# EasyEDA schematic smopcb.json
TITLE: Sheet_1; REV: 1.0; Date: 2026-06-30; Sheet: 1/1; Company: Your Company
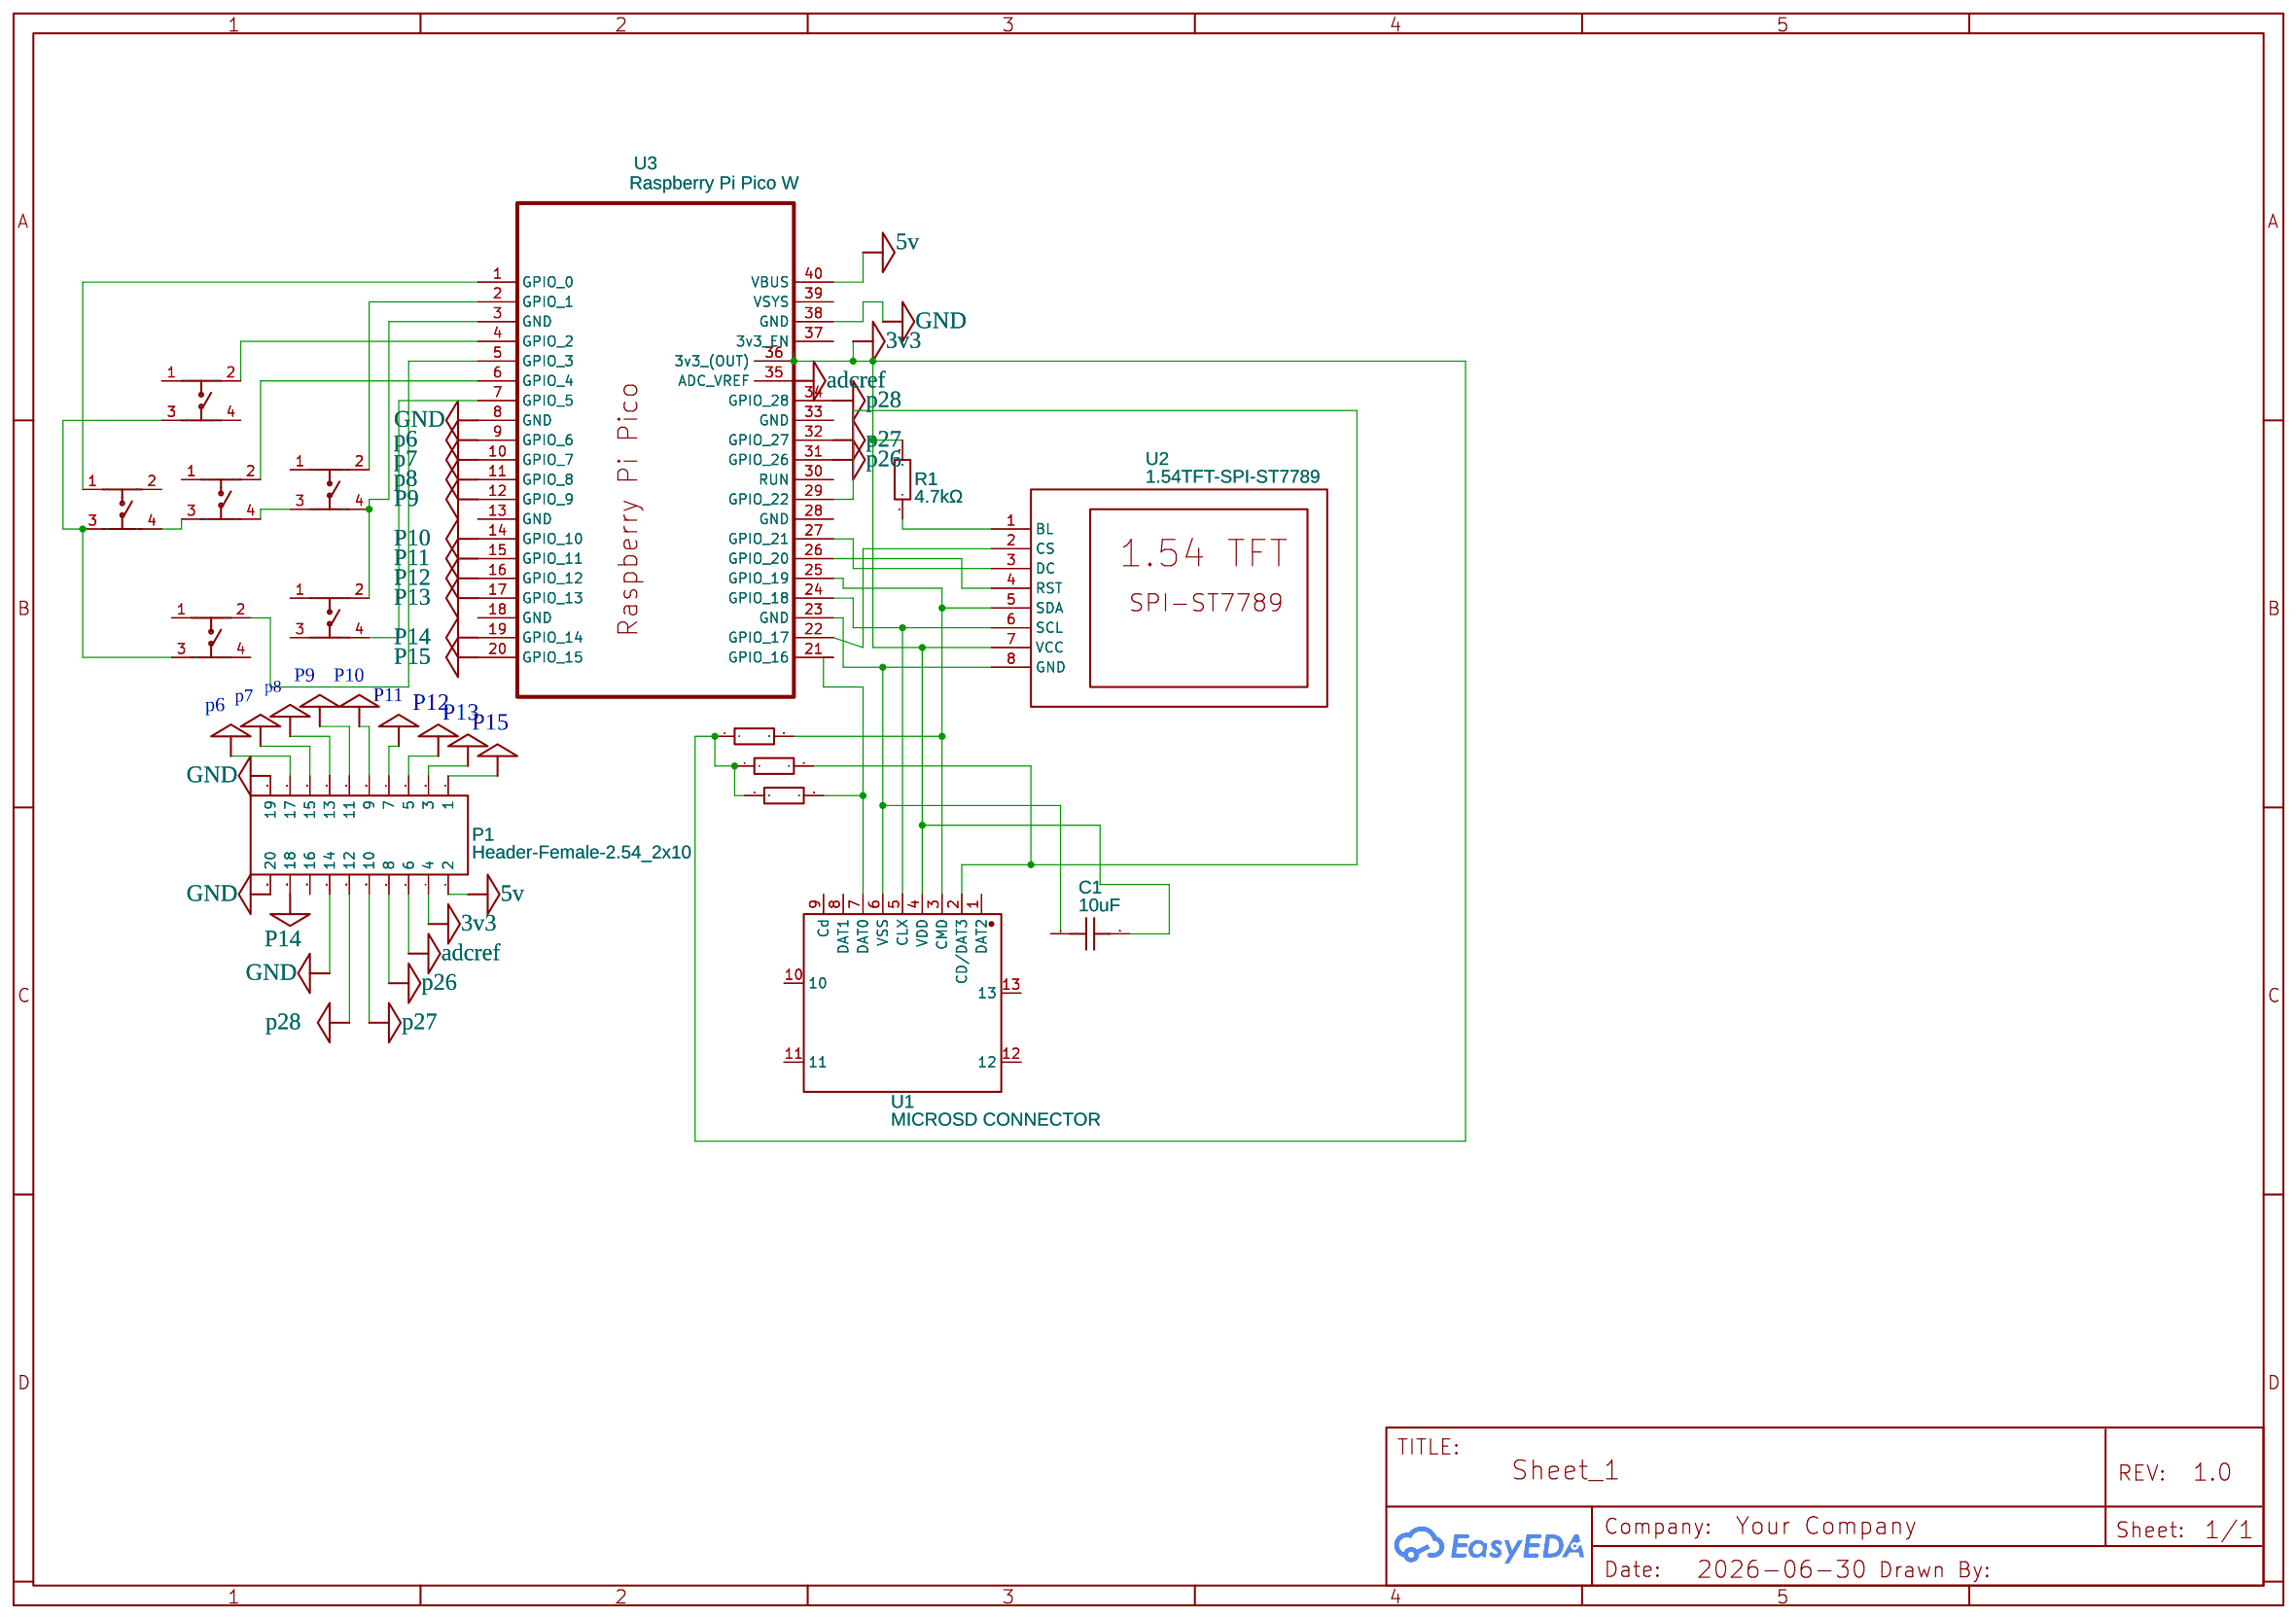
[diagram p0: schematic sheet]

## Parts
C1  10uF  [C0805]
KEY1  4PINTACTPCBTHTPUSHBUTTON  [SW-SMD_4P-L6.0-W6.0-P4.50-LS10.0_TL3301EF160QG]
KEY2  4PINTACTPCBTHTPUSHBUTTON  [SW-SMD_4P-L6.0-W6.0-P4.50-LS10.0_TL3301EF160QG]
KEY3  4PINTACTPCBTHTPUSHBUTTON  [SW-SMD_4P-L6.0-W6.0-P4.50-LS10.0_TL3301EF160QG]
KEY4  4PINTACTPCBTHTPUSHBUTTON  [SW-SMD_4P-L6.0-W6.0-P4.50-LS10.0_TL3301EF160QG]
KEY5  4PINTACTPCBTHTPUSHBUTTON  [SW-SMD_4P-L6.0-W6.0-P4.50-LS10.0_TL3301EF160QG]
KEY6  4PINTACTPCBTHTPUSHBUTTON  [SW-SMD_4P-L6.0-W6.0-P4.50-LS10.0_TL3301EF160QG]
P1  Header-Female-2.54_2x10  [HDR-TH_20P-P2.54-V-F-R2-C10-S2.54]
R1  4.7kΩ  [R0805]
R2  4.7kΩ  [R0805]
R3  4.7kΩ  [R0805]
R4  4.7kΩ  [R0805]
U1  MICROSD CONNECTOR  [SDCARD-SMD_CQMICRO_SDCARD_CQ036_HMA19PSMT]
U2  1.54TFT-SPI-ST7789  [1.54TFT-SPI-ST7789]
U3  Raspberry Pi Pico W  [RASPBERRY PI PICO/ RASPBERRY PI PICO W]

## Library data of the parts
C1 = 0805X5R106K350NT: Supplier: LCSC; Supplier Part: C49326680; Manufacturer: AIDE(爱迪电容); JLCPCB Part Class: Extended Part; Contributor: lcsc
KEY1-KEY6 = 4PINTACTPCBTHTPUSHBUTTON: Contributor: LCSC; Supplier: LCSC; Supplier Part: C9900003768; Manufacturer: null; Manufacturer Part: 4pinTACTPCBTHTPushButton; JLCPCB Part Class: Extended Part
P1 = Header-Female-2.54_2x10: Supplier: LCSC; Manufacturer: BOOMELE(博穆精密); Manufacturer Part: 2.54-2*10P母; Supplier Part: C30867; JLCPCB Part Class: Extended Part
R1 = RESISTOR 0805 4K7: Supplier: LCSC; Manufacturer: YAGEO(国巨); Manufacturer Part: RC0805FR-074K7L; Supplier Part: C60816; JLCPCB Part Class: Extended Part
R2-R4 = RMC08054.7K1%N: Contributor: LCSC; Supplier: LCSC; Supplier Part: C269746; Manufacturer: Tyohm(幸亚电阻); JLCPCB Part Class: Extended Part
U1 = MICROSD CONNECTOR: Supplier: LCSC; Supplier Part: C9900168162; Manufacturer: null; Manufacturer Part: CQMicro_SDCARD_CQ036_HMA19PSMT; JLCPCB Part Class: Extended Part; Contributor: lcsc
U2 = 1.54TFT-SPI-ST7789: Contributor: guillaume.lairot
U3 = Raspberry Pi Pico W: Contributor: timothyhobbs22

## Nets
3v3: C1.2 P1.4 R1.2 R2.1 R3.1 R4.1 U1.4(VDD) U2.7(VCC) U3.36(3v3 (OUT))
5v: P1.2 U3.40(VBUS)
GND: P1.14 P1.19 P1.20 U3.8(GND) U3.38(GND)
adcref: P1.6 U3.35(ADC_VREF)
p6: P1.17 U3.9(GPIO 6)
p7: P1.15 U3.10(GPIO 7)
p8: P1.13 U3.11(GPIO 8)
P9: P1.11 U3.12(GPIO 9)
P10: P1.9 U3.14(GPIO 10)
P11: P1.7 U3.15(GPIO 11)
P12: P1.5 U3.16(GPIO 12)
P13: P1.3 U3.17(GPIO 13)
P14: P1.18 U3.19(GPIO 14)
P15: P1.1 U3.20(GPIO 15)
p26: P1.8 U3.31(GPIO 26)
p27: P1.10 U3.32(GPIO 27)
p28: P1.12 U3.34(GPIO 28)
Net-(C1-1): C1.1 U1.6(VSS) U2.8(GND) U3.23(GND)
Net-(KEY1-2): KEY1.2 U3.4(GPIO 2)
Net-(KEY1-3): KEY1.3 KEY2.3 KEY3.3
Net-(KEY2-2): KEY2.2 U3.5(GPIO 3)
Net-(KEY3-1): KEY3.1 U3.1(GPIO 0)
Net-(KEY3-4): KEY3.4 KEY5.3
Net-(KEY4-2): KEY4.2 U3.2(GPIO 1)
Net-(KEY4-3): KEY4.3 KEY5.4
Net-(KEY4-4): KEY4.4 KEY6.2 U3.3(GND)
Net-(KEY5-2): KEY5.2 U3.6(GPIO 4)
Net-(KEY6-4): KEY6.4 U3.7(GPIO 5)
Net-(R1-1): R1.1 U2.1(BL)
Net-(R2-2): R2.2 U1.2(CD/DAT3) U3.29(GPIO 22)
Net-(R3-2): R3.2 U1.7(DAT0) U3.21(GPIO 16)
Net-(R4-2): R4.2 U1.3(CMD) U2.5(SDA) U3.25(GPIO 19)
Net-(U1-5): U1.5(CLX) U2.6(SCL) U3.24(GPIO 18)
Net-(U2-2): U2.2(CS) U3.22(GPIO 17)
Net-(U2-3): U2.3(DC) U3.27(GPIO 21)
Net-(U2-4): U2.4(RST) U3.26(GPIO 20)

Not connected (* = marked no-connect by the designer): KEY1 1 4; KEY2 1 4; KEY3 2; KEY4 1; KEY5 1; KEY6 1 3; P1 16; U1 1(DAT2) 8(DAT1) 9(Cd) 10 11 12 13; U3 13(GND) 18(GND) 28(GND) 30(RUN) 33(GND) 37(3v3_EN) 39(VSYS)
